# Altium schematic sheet SAMV71_tito_shield.SchDoc: SAMV71 Shield
size A; SheetNumber: 1; SheetTotal: 1
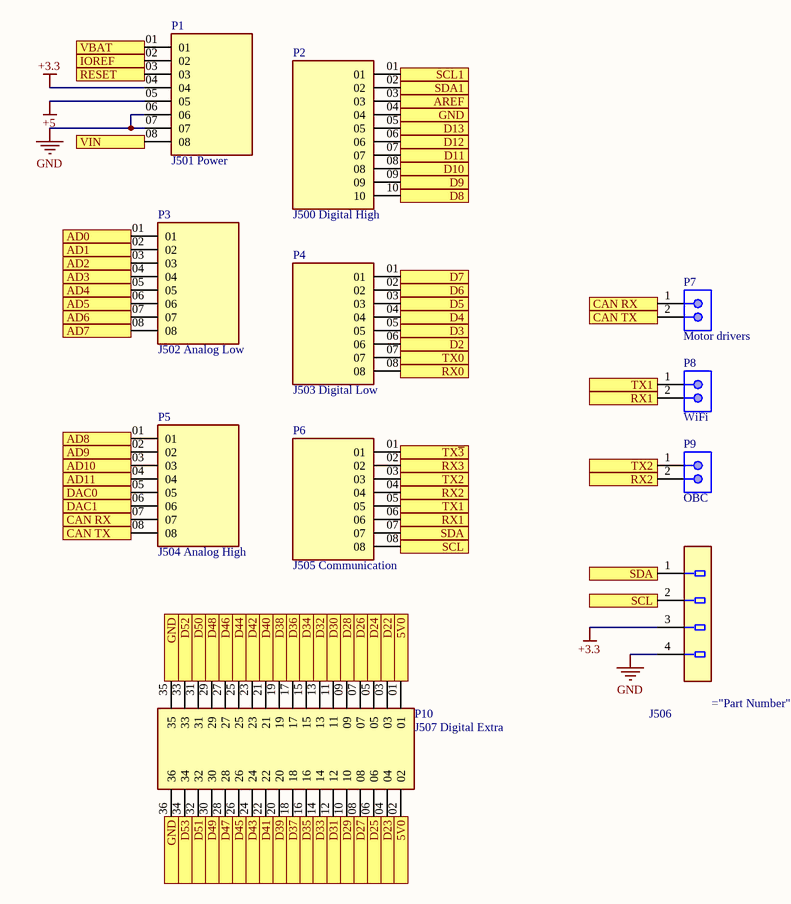
[diagram p0: SAMV71_tito_shield.SchDoc]

## Parts
J506  (no value)  [Molex_22-27-2041_0]
P1  J501 Power  [SAMTEC_TSW-108-07-G-S]
P2  J500 Digital High  [PCBComponent_1]
P3  J502 Analog Low  [SAMTEC_TSW-108-07-G-S]
P4  J503 Digital Low  [SAMTEC_TSW-108-07-G-S]
P5  J504 Analog High  [SAMTEC_TSW-108-07-G-S]
P6  J505 Communication  [SAMTEC_TSW-108-07-G-S]
P7  Motor drivers  [MOLX-22-23-2021_V]
P8  WiFi  [MOLX-22-23-2021_V]
P9  OBC  [MOLX-22-23-2021_V]
P10  J507 Digital Extra  [SAMTEC_TSW-118-07-G-D]

## Ports
5V0, AD0, AD1, AD2, AD3, AD4, AD5, AD6, AD7, AD8, AD9, AD10, AD11, AREF, CAN RX, CAN TX, D2, D3, D4, D5, D6, D7, D8, D9, D10, D11, D12, D13, D22, D23, D24, D25, D26, D27, D28, D29, D30, D31, D32, D33, D34, D35, D36, D37, D38, D39, D40, D41, D42, D43, D44, D45, D46, D47, D48, D49, D50, D51, D52, D53, DAC0, DAC1, GND, IOREF, RESET, RX0, RX1, RX2, RX3, SCL, SCL1, SDA, SDA1, TX0, TX1, TX2, TX~{3}, VBAT, VIN

## Nets
+3.3: J506.3 P1.04
+5: P1.05
GND: J506.4 P1.06 P1.07
5V0: P10.01 P10.02 ; port 5V0
AD0: P3.01 ; port AD0
AD1: P3.02 ; port AD1
AD2: P3.03 ; port AD2
AD3: P3.04 ; port AD3
AD4: P3.05 ; port AD4
AD5: P3.06 ; port AD5
AD6: P3.07 ; port AD6
AD7: P3.08 ; port AD7
AD8: P5.01 ; port AD8
AD9: P5.02 ; port AD9
AD10: P5.03 ; port AD10
AD11: P5.04 ; port AD11
AREF: P2.03 ; port AREF
CAN RX: P5.07 P7.1 ; port CAN RX
CAN TX: P5.08 P7.2 ; port CAN TX
D2: P4.06 ; port D2
D3: P4.05 ; port D3
D4: P4.04 ; port D4
D5: P4.03 ; port D5
D6: P4.02 ; port D6
D7: P4.01 ; port D7
D8: P2.10 ; port D8
D9: P2.09 ; port D9
D10: P2.08 ; port D10
D11: P2.07 ; port D11
D12: P2.06 ; port D12
D13: P2.05 ; port D13
D22: P10.03 ; port D22
D23: P10.04 ; port D23
D24: P10.05 ; port D24
D25: P10.06 ; port D25
D26: P10.07 ; port D26
D27: P10.08 ; port D27
D28: P10.09 ; port D28
D29: P10.10 ; port D29
D30: P10.11 ; port D30
D31: P10.12 ; port D31
D32: P10.13 ; port D32
D33: P10.14 ; port D33
D34: P10.15 ; port D34
D35: P10.16 ; port D35
D36: P10.17 ; port D36
D37: P10.18 ; port D37
D38: P10.19 ; port D38
D39: P10.20 ; port D39
D40: P10.21 ; port D40
D41: P10.22 ; port D41
D42: P10.23 ; port D42
D43: P10.24 ; port D43
D44: P10.25 ; port D44
D45: P10.26 ; port D45
D46: P10.27 ; port D46
D47: P10.28 ; port D47
D48: P10.29 ; port D48
D49: P10.30 ; port D49
D50: P10.31 ; port D50
D51: P10.32 ; port D51
D52: P10.33 ; port D52
D53: P10.34 ; port D53
DAC0: P5.05 ; port DAC0
DAC1: P5.06 ; port DAC1
GND: P2.04 P10.35 P10.36 ; port GND  [a separate net that carries the same name]
IOREF: P1.02 ; port IOREF
RESET: P1.03 ; port RESET
RX0: P4.08 ; port RX0
RX1: P6.06 P8.2 ; port RX1
RX2: P6.04 P9.2 ; port RX2
RX3: P6.02 ; port RX3
SCL: J506.2 P6.08 ; port SCL
SCL1: P2.01 ; port SCL1
SDA: J506.1 P6.07 ; port SDA
SDA1: P2.02 ; port SDA1
TX0: P4.07 ; port TX0
TX1: P6.05 P8.1 ; port TX1
TX2: P6.03 P9.1 ; port TX2
TX~{3}: P6.01 ; port TX~{3}
VBAT: P1.01 ; port VBAT
VIN: P1.08 ; port VIN

## Library data of the parts
J506 = 22-27-2041
P1 P3-P6 = TSW-108-07-G-S: MF: Samtec; Availability: Unavailable; Package: None; MP: TSW-108-07-G-S; Value: *; Price: None
P2 = Component_1
P7-P9 = 22-23-2021: Male Header, Pitch 2.54 mm, 1 x 2 Position, Height 10.67 mm, Tail Length 3.56 mm, 0 to 75 degC, RoHS, Bulk; Series name: 6373; Rated Voltage: 250V; Wire connection method: Solder; Rated current: 4/ContactA; Number of poles: 2; Contact point finish: Tin Over Copper; Maximum service temperature: 75C; Number of arrays: 1; Minimum service temperature: 0C; Shape/Type: Straight; Pitch: 2.54mm; Width: 6.35mm; PartNumber: 22-23-2021; ComponentLink1Description: Manufacturer URL; ComponentLink2Description: Datasheet; ComponentLink1URL: http://www.molex.com/; ComponentLink2URL: https://datasheet.ciiva.com/19454/232266-19454304.pdf; Length: 5.08mm; Height: 10.67mm; Mounting Technology: Through Hole; PackageDescription: Male Header, Pitch 2.54 mm, 1 x 2 Position, Height 10.67 mm, Tail Length 3.56 mm
P10 = TSW-118-07-G-D: MF: Samtec Inc.; Availability: Unavailable; Price: None; Value: *; MP: TSW-118-07-G-D; Package: None